# EAGLE schematic nanoled tip120 (EAGLE 7.6.0)
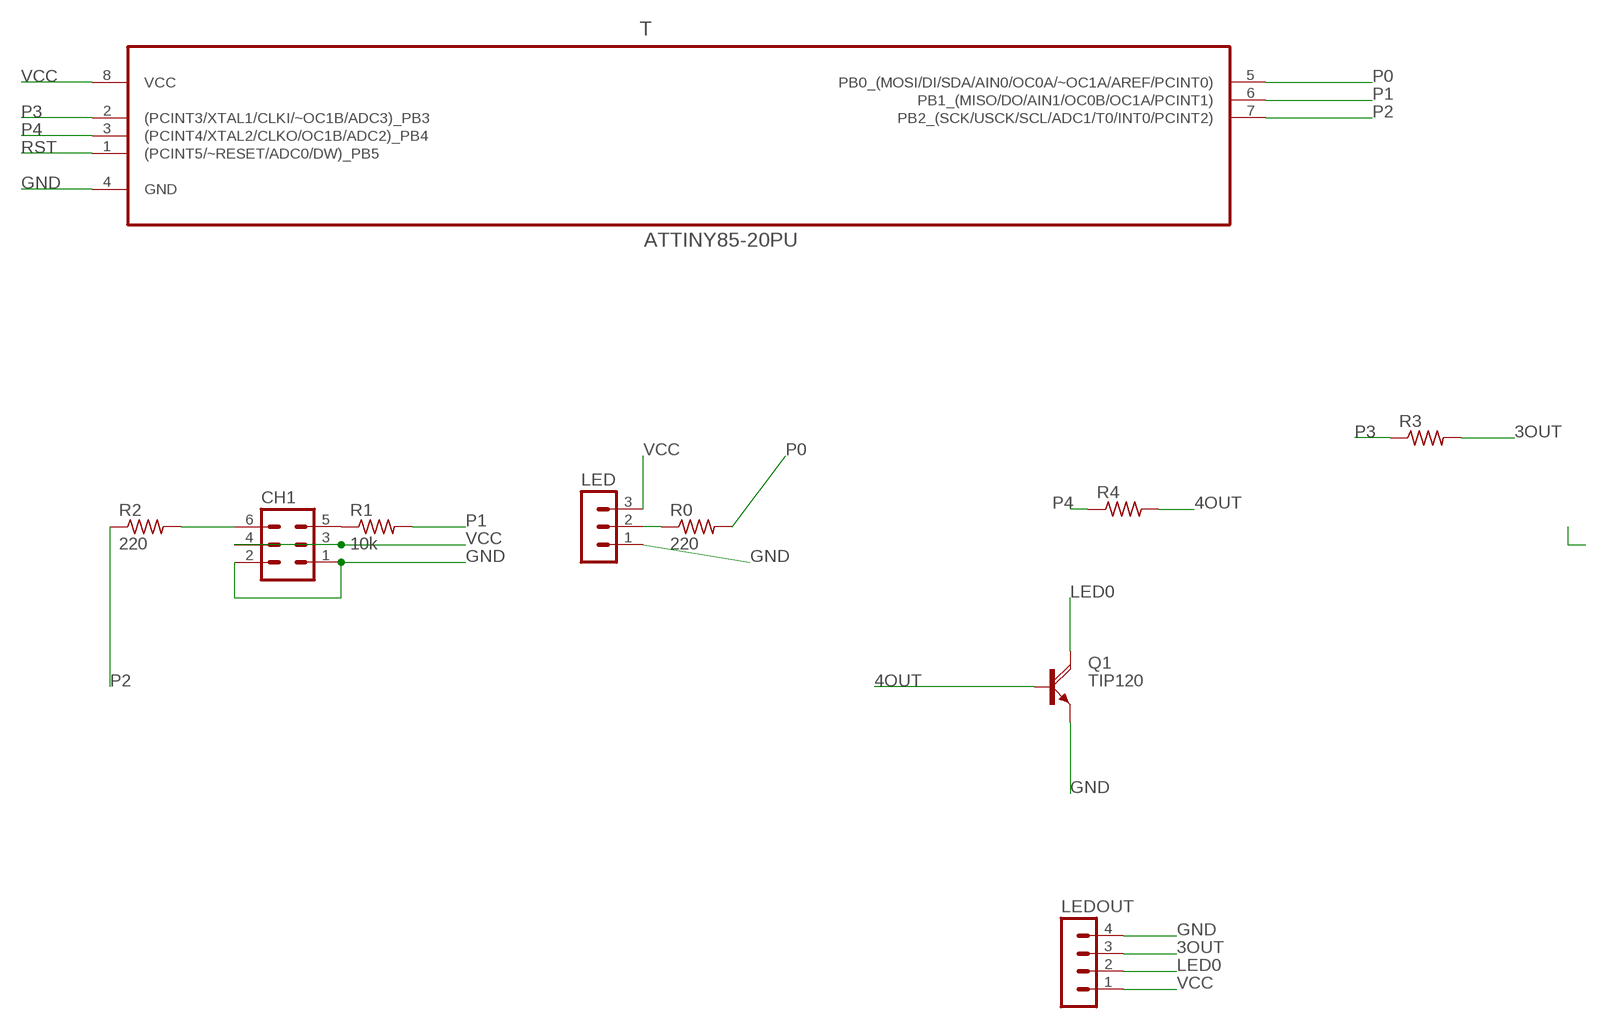
[diagram p0: schematic, sheet 1]

## Parts
CH1  MA03-2  [MA03-2]
LED  MA03-1  [MA03-1]
LEDOUT  MA04-1  [MA04-1]
Q1  TIP120  [TO220AH]
R0  220  R-US_0204/7  [0204/7]
R1  10k  R-US_0204/7  [0204/7]
R2  220  R-US_0204/7  [0204/7]
R3  R-US_0204/7  [0204/7]
R4  R-US_0204/7  [0204/7]
T  ATTINY85-20PU  [DIP254P762X533-8]

## Nets
3OUT: LEDOUT.3 R3.2
4OUT: Q1.B R4.2
GND: CH1.1 CH1.2 LED.1 LEDOUT.4 Q1.E T.4(GND)
LED0: LEDOUT.2 Q1.C
N$1: LED.2 R0.1
N$2: CH1.5 R1.1
N$4: CH1.6 R2.2
P0: R0.2 T.5(PB0_(MOSI/DI/SDA/AIN0/OC0A/~OC1A/AREF/PCINT0))
P1: R1.2 T.6(PB1_(MISO/DO/AIN1/OC0B/OC1A/PCINT1))
P2: R2.1 T.7(PB2_(SCK/USCK/SCL/ADC1/T0/INT0/PCINT2))
P3: R3.1 T.2((PCINT3/XTAL1/CLKI/~OC1B/ADC3)_PB3)
P4: R4.1 T.3((PCINT4/XTAL2/CLKO/OC1B/ADC2)_PB4)
RST: T.1((PCINT5/~RESET/ADC0/DW)_PB5)
VCC: CH1.3 CH1.4 LED.3 LEDOUT.1 T.8(VCC)

## Library data of the parts
CH1 = con-lstb:MA03-2: PIN HEADER; OC_FARNELL: unknown; OC_NEWARK: unknown
LED = con-lstb:MA03-1: PIN HEADER; OC_FARNELL: unknown; OC_NEWARK: unknown
LEDOUT = con-lstb:MA04-1: PIN HEADER; OC_FARNELL: unknown; OC_NEWARK: unknown
Q1 = transistor-power:TIP120: NPN DARLINGTON TRANSISTOR
R0 R1-R4 = resistor:R-US_: RESISTOR, American symbol
T = Atmel_By_element14_Batch_1-00:ATTINY85-20PU: 8-bit Microcontroller with In-System Programmable Flash; MPN: ATTINY85-20PU; OC_FARNELL: 1455162; OC_NEWARK: 58M3796; PACKAGE: PDIP-8; SUPPLIER: Atmel